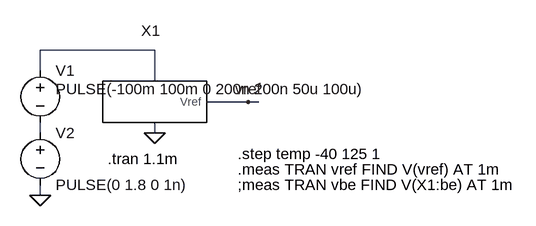
[diagram p0: schematic tb_bandgap.asc]
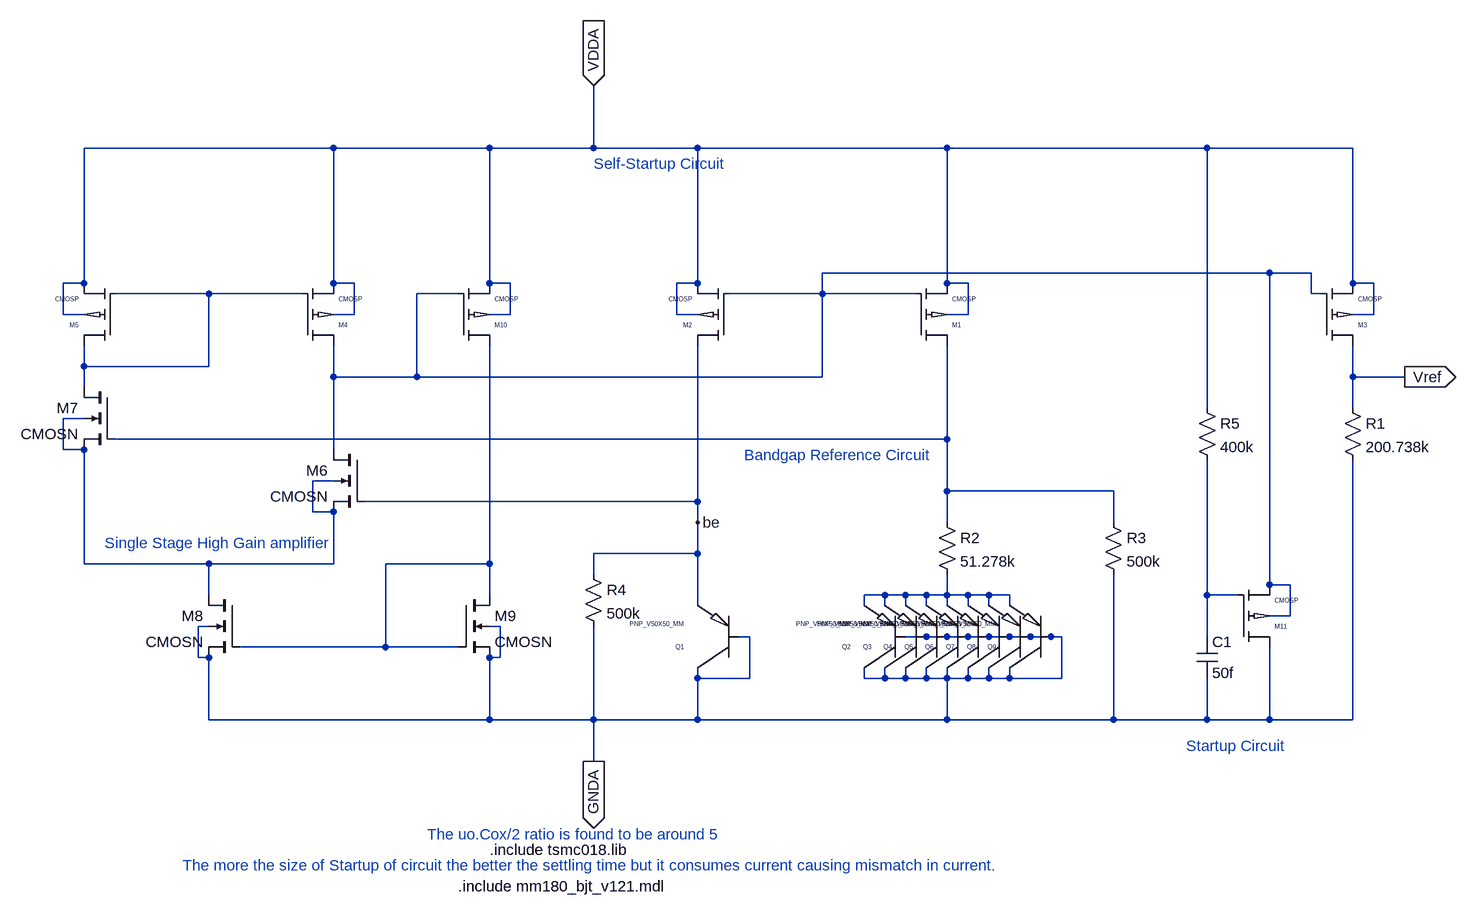
[diagram p1: sub-circuit bandgap_reference.asc]
tb_bandgap.asc, the LTspice schematic file:
Version 4
SHEET 1 880 680
WIRE 176 96 0 96
WIRE 0 128 0 96
WIRE 176 144 176 96
WIRE 320 176 256 176
WIRE 336 176 320 176
WIRE 0 224 0 208
WIRE 176 224 176 208
WIRE 0 320 0 304
FLAG 176 224 0
FLAG 320 176 vref
FLAG 0 320 0
SYMBOL Bandgap_Reference 160 176 R0
SYMATTR InstName X1
SYMBOL voltage 0 112 R0
WINDOW 3 24 44 Left 2
WINDOW 123 0 0 Left 0
WINDOW 39 0 0 Left 0
SYMATTR Value PULSE(-100m 100m 0 200n 200n 50u 100u)
SYMATTR InstName V1
SYMBOL voltage 0 208 R0
WINDOW 123 0 0 Left 0
WINDOW 39 0 0 Left 0
SYMATTR InstName V2
SYMATTR Value PULSE(0 1.8 0 1n)
TEXT 104 264 Left 2 !.tran 1.1m
TEXT 304 256 Left 2 !.step temp -40 125 1
TEXT 304 304 Left 2 !;meas TRAN vbe FIND V(X1:be) AT 1m
TEXT 304 280 Left 2 !.meas TRAN vref FIND V(vref) AT 1m

bandgap_reference.asc, the sub-circuit schematic file:
Version 4
SHEET 1 2156 776
WIRE -352 -416 -736 -416
WIRE -112 -416 -352 -416
WIRE 48 -416 48 -512
WIRE 48 -416 -112 -416
WIRE 208 -416 48 -416
WIRE 592 -416 208 -416
WIRE 992 -416 592 -416
WIRE 1216 -416 992 -416
WIRE 1088 -224 400 -224
WIRE 1152 -224 1088 -224
WIRE -736 -208 -736 -416
WIRE -736 -208 -768 -208
WIRE -352 -208 -352 -416
WIRE -320 -208 -352 -208
WIRE -112 -208 -112 -416
WIRE -80 -208 -112 -208
WIRE 208 -208 208 -416
WIRE 208 -208 176 -208
WIRE 592 -208 592 -416
WIRE 624 -208 592 -208
WIRE 1216 -208 1216 -416
WIRE 1248 -208 1216 -208
WIRE -544 -192 -688 -192
WIRE -400 -192 -544 -192
WIRE -160 -192 -224 -192
WIRE 400 -192 400 -224
WIRE 400 -192 256 -192
WIRE 544 -192 400 -192
WIRE 1152 -192 1152 -224
WIRE 1168 -192 1152 -192
WIRE -768 -160 -768 -208
WIRE -736 -160 -768 -160
WIRE -320 -160 -320 -208
WIRE -320 -160 -352 -160
WIRE -80 -160 -80 -208
WIRE -80 -160 -112 -160
WIRE 176 -160 176 -208
WIRE 208 -160 176 -160
WIRE 624 -160 624 -208
WIRE 624 -160 592 -160
WIRE 1248 -160 1248 -208
WIRE 1248 -160 1216 -160
WIRE -736 -80 -736 -112
WIRE -544 -80 -544 -192
WIRE -544 -80 -736 -80
WIRE -352 -64 -352 -112
WIRE -224 -64 -224 -192
WIRE -224 -64 -352 -64
WIRE 400 -64 400 -192
WIRE 400 -64 -224 -64
WIRE 1216 -64 1216 -112
WIRE 1296 -64 1216 -64
WIRE -736 -48 -736 -80
WIRE 992 -16 992 -416
WIRE 1216 -16 1216 -64
WIRE -736 0 -768 0
WIRE 592 32 592 -112
WIRE 592 32 -688 32
WIRE -768 48 -768 0
WIRE -736 48 -768 48
WIRE -352 48 -352 -64
WIRE -352 96 -384 96
WIRE 592 112 592 32
WIRE 848 112 592 112
WIRE 208 128 208 -112
WIRE 208 128 -304 128
WIRE -384 144 -384 96
WIRE -352 144 -384 144
WIRE 208 160 208 128
WIRE 592 160 592 112
WIRE 848 160 848 112
WIRE 208 208 208 160
WIRE 208 208 48 208
WIRE -736 224 -736 48
WIRE -544 224 -736 224
WIRE -352 224 -352 144
WIRE -352 224 -544 224
WIRE -112 224 -112 -112
WIRE -112 224 -272 224
WIRE 48 240 48 208
WIRE 1088 256 1088 -224
WIRE 1120 256 1088 256
WIRE -544 272 -544 224
WIRE -112 272 -112 224
WIRE 496 272 464 272
WIRE 528 272 496 272
WIRE 560 272 528 272
WIRE 592 272 592 240
WIRE 592 272 560 272
WIRE 624 272 592 272
WIRE 656 272 624 272
WIRE 688 272 656 272
WIRE 992 272 992 64
WIRE 1040 272 992 272
WIRE 208 288 208 208
WIRE 464 288 464 272
WIRE 496 288 496 272
WIRE 528 288 528 272
WIRE 560 288 560 272
WIRE 592 288 592 272
WIRE 624 288 624 272
WIRE 656 288 656 272
WIRE 688 288 688 272
WIRE 1120 304 1120 256
WIRE 1120 304 1088 304
WIRE -544 320 -560 320
WIRE -96 320 -112 320
WIRE 288 336 272 336
WIRE 560 336 528 336
WIRE 592 336 560 336
WIRE 624 336 592 336
WIRE 656 336 624 336
WIRE 688 336 656 336
WIRE 720 336 688 336
WIRE 752 336 720 336
WIRE 768 336 752 336
WIRE 992 336 992 272
WIRE -272 352 -272 224
WIRE -272 352 -496 352
WIRE -160 352 -272 352
WIRE -560 368 -560 320
WIRE -544 368 -560 368
WIRE -96 368 -96 320
WIRE -96 368 -112 368
WIRE 208 400 208 384
WIRE 288 400 288 336
WIRE 288 400 208 400
WIRE 464 400 464 384
WIRE 496 400 496 384
WIRE 496 400 464 400
WIRE 528 400 528 384
WIRE 528 400 496 400
WIRE 560 400 560 384
WIRE 560 400 528 400
WIRE 592 400 592 384
WIRE 592 400 560 400
WIRE 624 400 624 384
WIRE 624 400 592 400
WIRE 656 400 656 384
WIRE 656 400 624 400
WIRE 688 400 688 384
WIRE 688 400 656 400
WIRE 768 400 768 336
WIRE 768 400 688 400
WIRE -544 464 -544 368
WIRE -112 464 -112 368
WIRE -112 464 -544 464
WIRE 48 464 48 320
WIRE 48 464 -112 464
WIRE 208 464 208 400
WIRE 208 464 48 464
WIRE 592 464 592 400
WIRE 592 464 208 464
WIRE 848 464 848 240
WIRE 848 464 592 464
WIRE 992 464 992 400
WIRE 992 464 848 464
WIRE 1088 464 1088 352
WIRE 1088 464 992 464
WIRE 1216 464 1216 64
WIRE 1216 464 1088 464
WIRE 48 528 48 464
FLAG 48 528 GNDA
IOPIN 48 528 Out
FLAG 48 -512 VDDA
IOPIN 48 -512 In
FLAG 1296 -64 Vref
IOPIN 1296 -64 Out
FLAG 208 160 be
SYMBOL cmosp 544 -112 M180
SYMATTR InstName M1
SYMATTR Value2 l=180n w=2.5u
SYMBOL cmosp 256 -112 R180
SYMATTR InstName M2
SYMATTR Value2 l=180n w=2.5u
SYMBOL cmosp 1168 -112 M180
SYMATTR InstName M3
SYMATTR Value2 l=180n w=2.5u
SYMBOL res 1200 -32 R0
SYMATTR InstName R1
SYMATTR Value 200.738k
SYMBOL res 576 144 R0
SYMATTR InstName R2
SYMATTR Value 51.278k
SYMBOL res 832 144 R0
SYMATTR InstName R3
SYMATTR Value 500k
SYMBOL pnp_v50x50_mm 272 384 R180
SYMATTR InstName Q1
SYMBOL res 32 224 R0
SYMATTR InstName R4
SYMATTR Value 500k
SYMBOL cmosp -400 -112 M180
SYMATTR InstName M4
SYMATTR Value2 l=180n w=2.5u
SYMBOL cmosp -688 -112 R180
SYMATTR InstName M5
SYMATTR Value2 l=180n w=2.5u
SYMBOL pnp_v50x50_mm 528 384 R180
SYMATTR InstName Q2
SYMBOL pnp_v50x50_mm 560 384 R180
SYMATTR InstName Q3
SYMBOL pnp_v50x50_mm 592 384 R180
SYMATTR InstName Q4
SYMBOL pnp_v50x50_mm 624 384 R180
SYMATTR InstName Q5
SYMBOL pnp_v50x50_mm 656 384 R180
SYMATTR InstName Q6
SYMBOL pnp_v50x50_mm 688 384 R180
SYMATTR InstName Q7
SYMBOL pnp_v50x50_mm 720 384 R180
SYMATTR InstName Q8
SYMBOL pnp_v50x50_mm 752 384 R180
SYMATTR InstName Q9
SYMBOL cmosn -304 48 M0
SYMATTR InstName M6
SYMATTR Value2 l=180n w=500n
SYMBOL cmosn -688 -48 M0
SYMATTR InstName M7
SYMATTR Value2 l=180n w=500n
SYMBOL cmosn -496 272 M0
SYMATTR InstName M8
SYMATTR Value2 l=180n w=2u
SYMBOL cmosn -160 272 R0
SYMATTR InstName M9
SYMATTR Value2 l=180n w=2u
SYMBOL cmosp -160 -112 M180
SYMATTR InstName M10
SYMATTR Value2 l=180n w=2.5u
SYMBOL cmosp 1040 352 M180
SYMATTR InstName M11
SYMATTR Value2 l=180n w=2.5u
SYMBOL res 976 -32 R0
SYMATTR InstName R5
SYMATTR Value 400k
SYMBOL cap 976 336 R0
SYMATTR InstName C1
SYMATTR Value 50f
TEXT -208 640 Left 2 ;The uo.Cox/2 ratio is found to be around 5
TEXT -112 664 Left 2 !.include tsmc018.lib
TEXT 48 -392 Left 2 ;Self-Startup Circuit
TEXT -704 192 Left 2 ;Single Stage High Gain amplifier
TEXT 280 56 Left 2 ;Bandgap Reference Circuit
TEXT -584 688 Left 2 ;The more the size of Startup of circuit the better the settling time but it consumes current causing mismatch in current.
TEXT -160 720 Left 2 !.include mm180_bjt_v121.mdl
TEXT 960 504 Left 2 ;Startup Circuit

The netlist it stands for:
* tb_bandgap.asc
XX1 N001 0 vref bandgap_reference
V1 N001 N002 PULSE(-100m 100m 0 200n 200n 50u 100u)
V2 N002 0 PULSE(0 1.8 0 1n)

* block symbol definitions
.subckt bandgap_reference VDDA GNDA Vref
M1 N004 N001 VDDA VDDA CMOSP l=180n w=2.5u
M2 be N001 VDDA VDDA CMOSP l=180n w=2.5u
M3 Vref N001 VDDA VDDA CMOSP l=180n w=2.5u
R1 Vref GNDA 200.738k
R2 N004 N006 51.278k
R3 N004 GNDA 500k
Q1 GNDA GNDA be 0 PNP_V50X50_MM
R4 be GNDA 500k
M4 N001 N002 VDDA VDDA CMOSP l=180n w=2.5u
M5 N002 N002 VDDA VDDA CMOSP l=180n w=2.5u
Q2 GNDA GNDA N006 0 PNP_V50X50_MM
Q3 GNDA GNDA N006 0 PNP_V50X50_MM
Q4 GNDA GNDA N006 0 PNP_V50X50_MM
Q5 GNDA GNDA N006 0 PNP_V50X50_MM
Q6 GNDA GNDA N006 0 PNP_V50X50_MM
Q7 GNDA GNDA N006 0 PNP_V50X50_MM
Q8 GNDA GNDA N006 0 PNP_V50X50_MM
Q9 GNDA GNDA N006 0 PNP_V50X50_MM
M6 N001 be N003 N003 CMOSN l=180n w=500n
M7 N002 N004 N003 N003 CMOSN l=180n w=500n
M8 N003 N005 GNDA GNDA CMOSN l=180n w=2u
M9 N005 N005 GNDA GNDA CMOSN l=180n w=2u
M10 N005 N001 VDDA VDDA CMOSP l=180n w=2.5u
M11 GNDA N007 N001 N001 CMOSP l=180n w=2.5u
R5 VDDA N007 400k
C1 N007 GNDA 50f
* The uo.Cox/2 ratio is found to be around 5
.include tsmc018.lib
* Self-Startup Circuit
* Single Stage High Gain amplifier
* Bandgap Reference Circuit
* The more the size of Startup of circuit the better the settling time but it consumes current causing mismatch in current.
.include mm180_bjt_v121.mdl
* Startup Circuit
.ends bandgap_reference

.model NPN NPN
.model PNP PNP
.lib standard.bjt
.model NMOS NMOS
.model PMOS PMOS
.lib standard.mos
.tran 1.1m
.step temp -40 125 1
;meas TRAN vbe FIND V(X1:be) AT 1m
.meas TRAN vref FIND V(vref) AT 1m
.lib tsmc018.lib
.lib mm180_bt_v121_tt.lib
.backanno
.end